# EAGLE design esp-switch-01 (EAGLE 7.1.0)
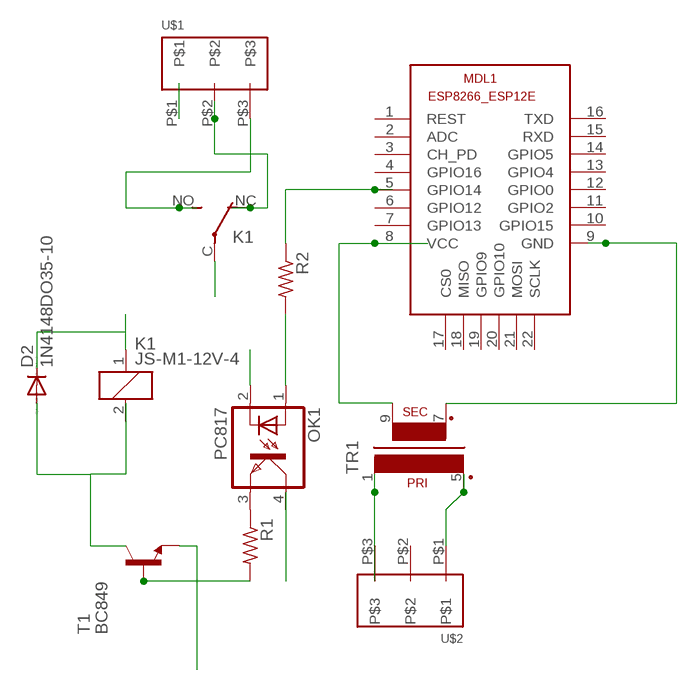
[diagram p0: schematic, sheet 1]

## Parts
D2  1N4148DO35-10  [DO35-10]
K1  JS-M1-12V-4  [JS-M]
MDL1  ESP8266-12EESP8266-ESP12E  [ESP8266-ESP12E]
OK1  PC817  [DIL04]
R1  R-US_0207/7  [0207/7]
R2  R-US_0207/7  [0207/7]
T1  BC849  [SOT23]
TR1  EI30-1  [EI30-1]
U$1  TBLOCK_3PIN_5MM  [TERMINAL_BLOCK_3_PIN_5_MM]
U$2  TBLOCK_3PIN_5MM  [TERMINAL_BLOCK_3_PIN_5_MM]

## Nets
GND: MDL1.9(GND) OK1.2(C) T1.2(E) TR1.7(S3)
LINE1 [supply]: TR1.1 U$1.P$1 U$2.P$3
LINE2 [supply]: K1.C(2:P) TR1.5(P2) U$2.P$1
N$1 [supply]: D2.A
N$3 [supply]: OK1.3(EMIT) R1.1
N$5 [supply]: K1.NC(2:O) U$1.P$2
N$7: MDL1.5(GPIO14) R2.1
N$8 [supply]: K1.NO(2:S) U$1.P$3
N$9 [supply]: OK1.1(A) R2.2
N$10 [supply]: R1.2 T1.1(B)
VCC: D2.C K1.1 MDL1.8(VCC) TR1.9(S4)
Unconnected: K1.2 MDL1.1(REST) MDL1.2(ADC) MDL1.3(CH_PD) MDL1.4(GPIO16) MDL1.6(GPIO12) MDL1.7(GPIO13) MDL1.10(GPIO15) MDL1.11(GPIO2) MDL1.12(GPIO0) MDL1.13(GPIO4) MDL1.14(GPIO5) MDL1.15(RXD) MDL1.16(TXD) MDL1.17(CS0) MDL1.18(MISO) MDL1.19(GPIO9) MDL1.20(GPIO10) MDL1.21(MOSI) MDL1.22(SCLK) OK1.4(COL) T1.3(C) U$2.P$2

## Library data of the parts
D2 = diode:1N4148: DIODE high speed (Philips)
K1 = relay:JS-M1*: Automotive Ultra-Miniature Power Relay NAiS Source: http://www.mew-europe.com/.. en_ds_61211_0000.pdf; MPN: JSM1-12V-4; OC_FARNELL: 910338; OC_NEWARK: 13P4552
MDL1 = ESP8266-ESP12E:ESP8266-12E: ESP8266-12E with additional I/O and GPIO04/05 corrected The author cannot warrant that this library is free from error or will meet your specific requirements. Created by PuceBaboon.com. Komagane, Nagano, JAPAN
OK1 = optocoupler:PC817: SHARP OPTO COUPLER; MPN: PC817X4J000F; OC_FARNELL: 9707727; OC_NEWARK: 97K7059
R1 R2 = resistor:R-US_: RESISTOR, American symbol
T1 = transistor:BC849: NPN TRANSISTOR
TR1 = trafo:EI30-1: TRANSFORMER 1 primary winding, 1 secondary winding ERA
U$1 U$2 = Connectors:TBLOCK_3PIN_5MM: 3 PIN Terminal Block 5 MM pitch

## Net classes
1 supply: width 25.4 mm, clearance 0.254 mm

## Board
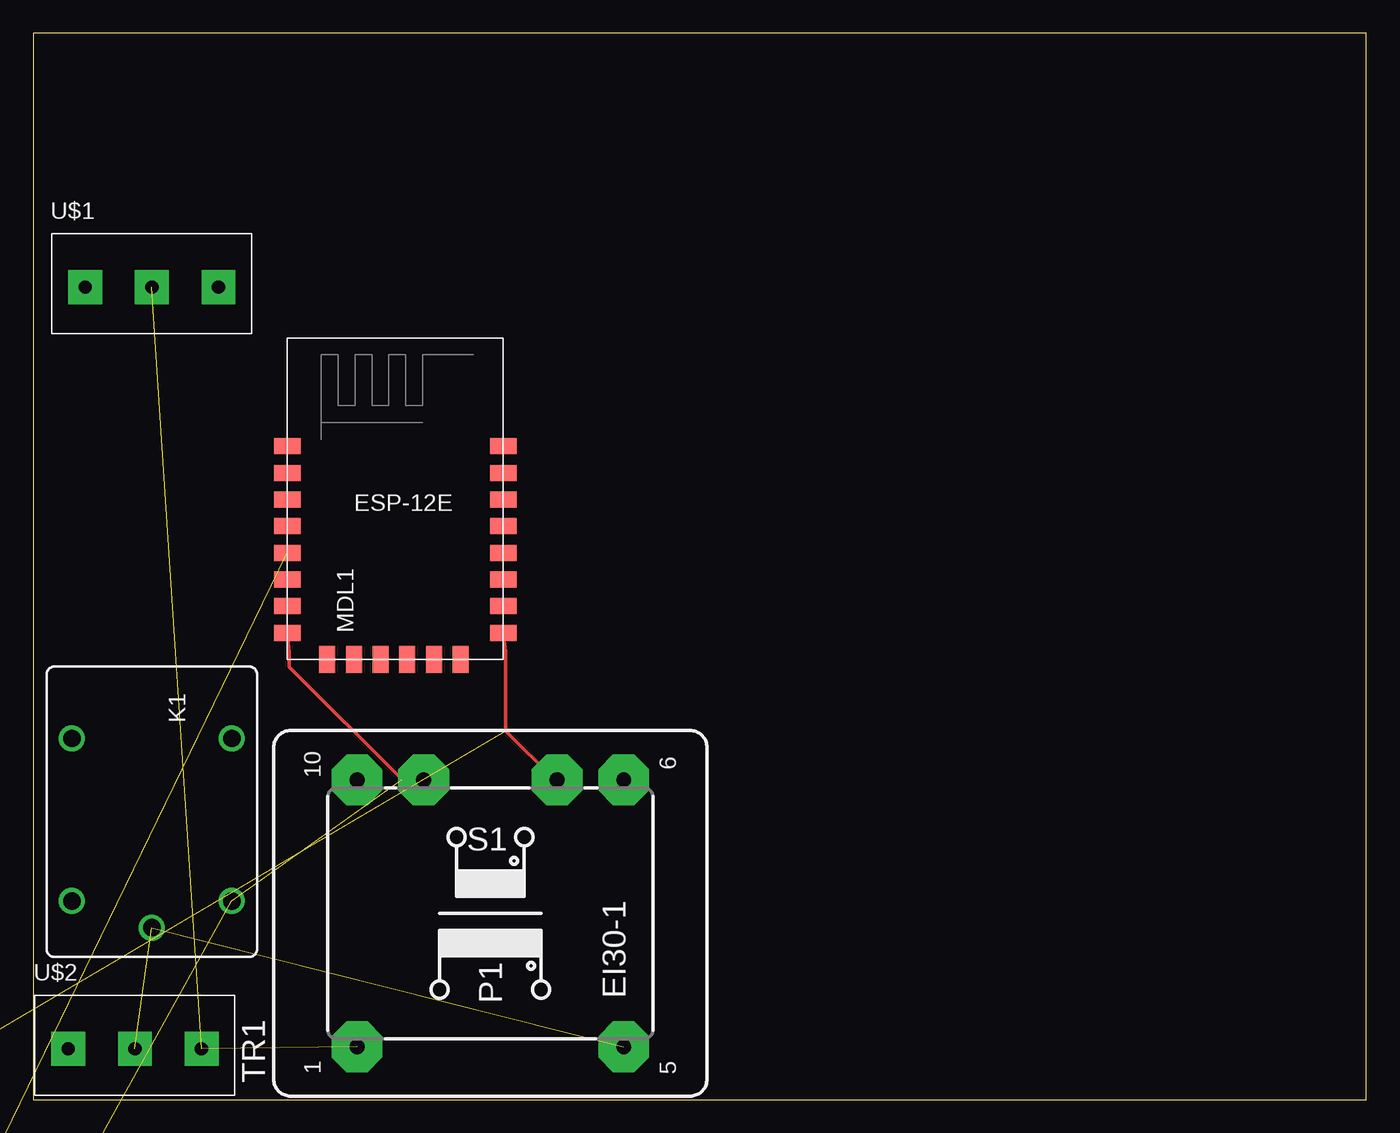
[diagram p1: board, top side]
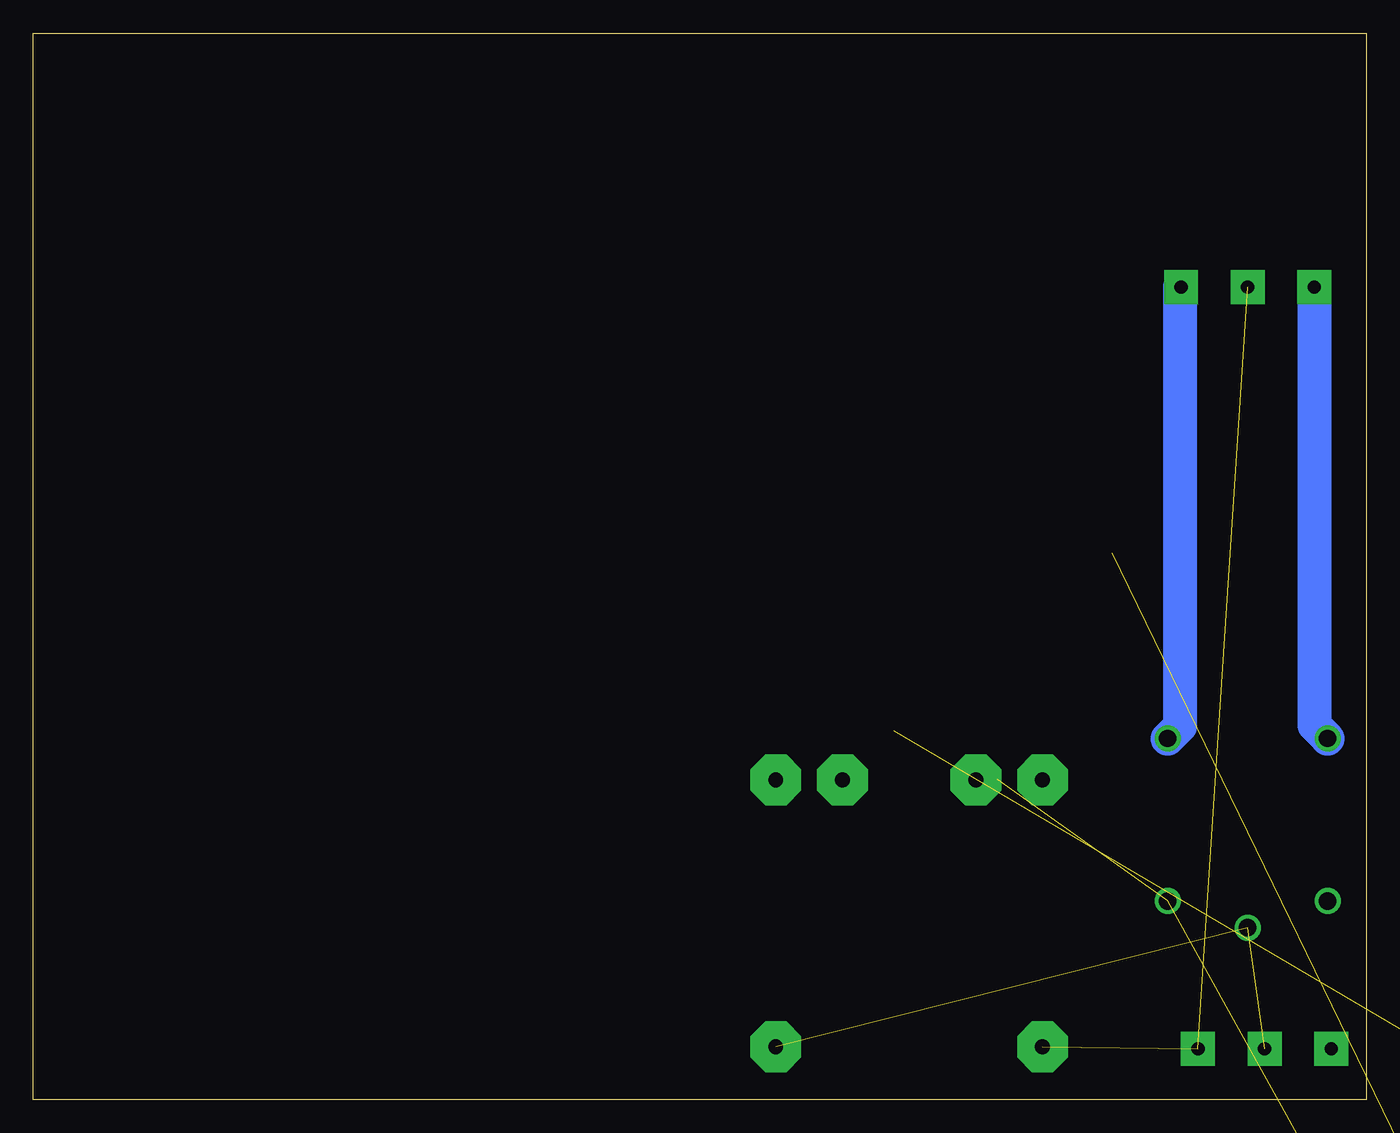
[diagram p2: board, bottom side, seen from below]

Size 100 x 80 mm. Coordinates in mm from the lower left corner, seen from the top.
Outline: 0,0 100,0 100,80 0,80 0,0
Copper layers (1*16): Top 0.035mm / dielectric 1.5mm / Bottom 0.035mm
Design rules "default": minimum track width 10mil, minimum drill 24mil, track to track 8mil, track to pad 8mil, pad to pad 8mil, via to via 8mil, smd to smd 8mil, copper to edge 40mil, drill to drill 8mil, minimum pad ring 10mil, minimum via ring 8mil, stop-mask expansion 4mil, vias tented up to drill 0mil, thermal gap 10mil

### Footprints (pad centres in the part's own frame; a part is rotated, then mirrored left to right if it is on the bottom)
DO35-10 = drill 0.813 long: A 5.08,0; C -5.08,0
JS-M = drill 1.3: 1 6.7,6; 2 6.7,-6; C 8.7,0; NC -5.5,-6; NO -5.5,6
ESP8266-ESP12E = smd 2 x 1.2: 1 -7.62,5.84; 2 -7.62,3.84; 3 -7.62,1.84; 4 -7.62,-0.16; 5 -7.62,-2.16; 6 -7.62,-4.16; 7 -7.62,-6.16; 8 -7.62,-8.16; 9 8.58,-8.16; 10 8.58,-6.16; 11 8.58,-4.16; 12 8.58,-2.16; 13 8.58,-0.16; 14 8.58,1.84; 15 8.58,3.84; 16 8.58,5.84 | smd 1.2 x 2: 17 -4.62,-10.16; 18 -2.62,-10.16; 19 -0.62,-10.16; 20 1.38,-10.16; 21 3.38,-10.16; 22 5.38,-10.16
DIL04 = drill 0.813 offset: 1 -1.27,-3.81; 2 1.27,-3.81; 3 1.27,3.81; 4 -1.27,3.81
0207/7 = drill 0.813 octagon: 1 -3.81,0; 2 3.81,0
SOT23 = smd 1 x 1.4: 1 -0.95,-1.1; 2 0.95,-1.1; 3 0,1.1
EI30-1 = drill 1.118 pad 3.81 octagon: 1 -10.008,10.008; 5 -10.008,-10.008; 6 10.008,-10.008; 7 10.008,-5.004; 9 10.008,5.004; 10 10.008,10.008
TERMINAL_BLOCK_3_PIN_5_MM = drill 1 pad 2.54 square: P$1 0,0; P$2 -5,0; P$3 5,0

### Placement (x,y rotation side)
D2  -3.81,-27.94 0 top  (outside the outline)
K1  8.89,21.59 270 top
MDL1  26.67,43.18 0 top
OK1  -6.35,7.62 0 top  (outside the outline)
R1  -5.08,-11.43 0 top  (outside the outline)
R2  -5.08,-16.51 0 top  (outside the outline)
T1  -7.62,-3.81 0 top  (outside the outline)
TR1  34.29,13.97 90 top
U$1  8.89,60.96 0 top
U$2  7.62,3.81 0 top

### Tracks (layer width: path | path; a pad name or v marks a point on that pad's centre or on a via)
GND  (2 unrouted)
  Top 0.254: MDL1.9 35.43,33.6 35.43,27.66 39.09,24 TR1.7
LINE1  (2 unrouted)
LINE2  (2 unrouted)
N$3  (1 unrouted)
N$5
  Bottom 2.54: U$1.P$2 3.89,28.09 K1.NC
N$7  (1 unrouted)
N$8
  Bottom 2.54: U$1.P$3 13.97,60.96 13.97,28.01 K1.NO
N$9  (1 unrouted)
N$10  (1 unrouted)
VCC  (2 unrouted)
  Top 0.254: MDL1.8 19.2,33.6 19.2,32.46 27.66,24 29.26,24 TR1.9